# Altium schematic sheet ProtocolAnalyzer.SchDoc
size A; SheetNumber: 1; SheetTotal: 1
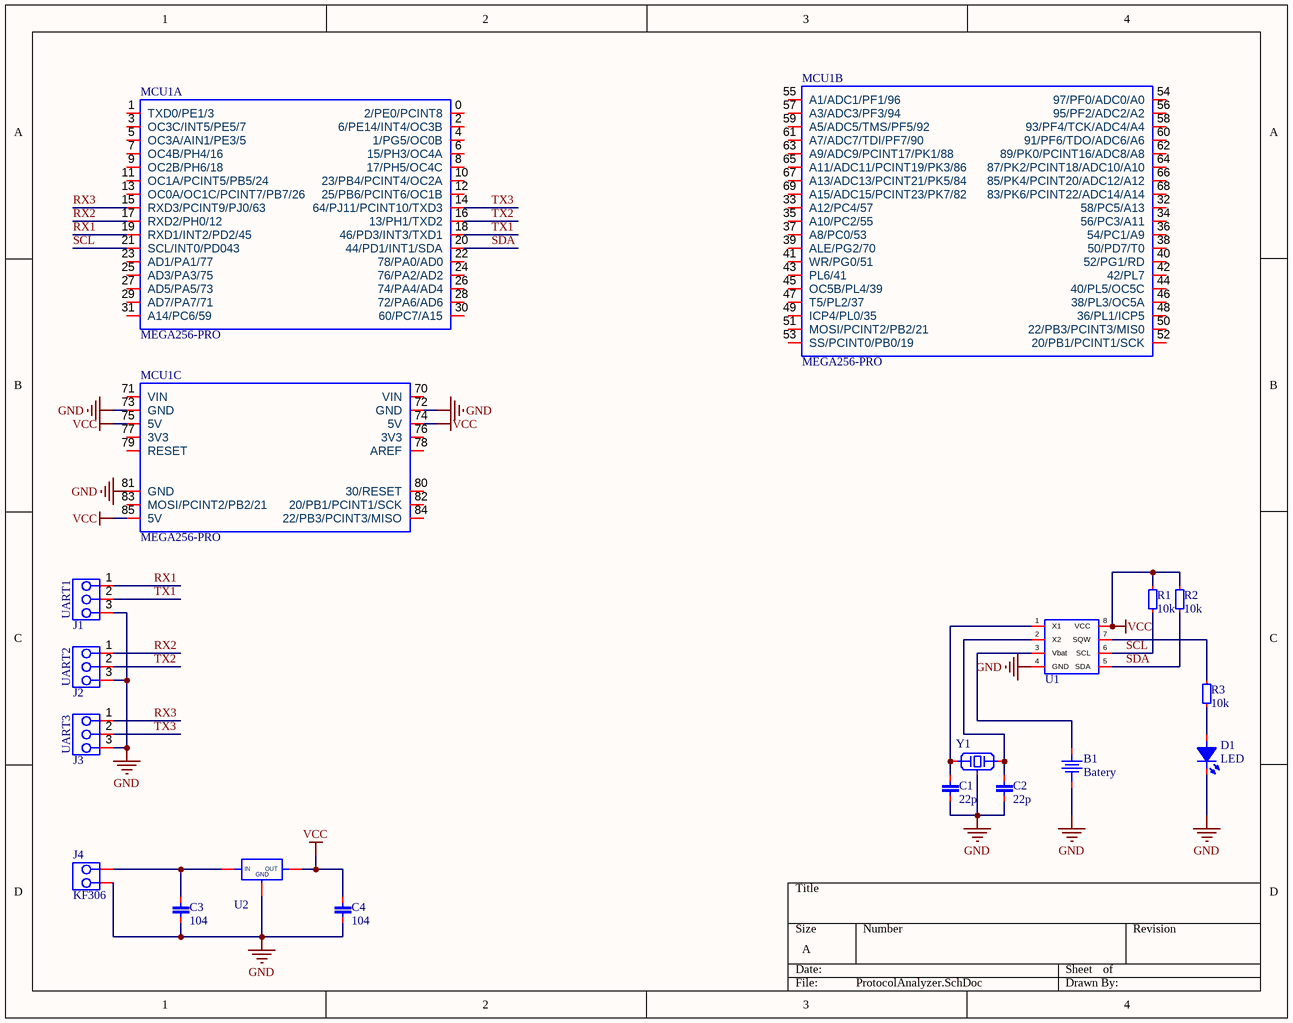
[diagram p0: ProtocolAnalyzer.SchDoc]

## Parts
B1  Batery  [CR1220]
C1  22p  [C0805]
C2  22p  [C0805]
C3  104  [C1206]
C4  104  [C1206]
D1  LED  [L0805RED]
J1  UART1  [JST - XH - Thru (R) - 3Pin - 2.54mm]
J2  UART2  [JST - XH - Thru (R) - 3Pin - 2.54mm]
J3  UART3  [JST - XH - Thru (R) - 3Pin - 2.54mm]
J4  KF306  [DG306-5.0-02P-12-00AH]
MCU1  MEGA256-PRO  [MEGA2560-PRO]  (parts A,B,C of 3)
R1  10k  [R0805]
R2  10k  [R0805]
R3  10k  [R0805]
U1  RealTime  [SOIC08_1.27_6.0]  (value not drawn)
U2  LM7805  [TO252-3]  (value not drawn)
Y1  32.768KHz  [DT-26]  (value not drawn)

## Nets
GND: B1.2 C1.1 C2.1 C3.2 C4.2 D1.2(K) J1.3 J2.3 J3.3 J4.2 MCU1.72(GND) MCU1.73(GND) MCU1.81(GND) U1.4(GND) U2.2(GND) Y1.3(GND)
VCC: C4.1 MCU1.74(5V) MCU1.75(5V) MCU1.85(5V) R1.2 R2.2 U1.8(VCC) U2.3(OUT)
RX1: J1.1 MCU1.19(RXD1/INT2/PD2/45)
RX2: J2.1 MCU1.17(RXD2/PH0/12)
RX3: J3.1 MCU1.15(RXD3/PCINT9/PJ0/63)
SCL: MCU1.21(SCL/INT0/PD043) R1.1 U1.6(SCL)
SDA: MCU1.20(44/PD1/INT1/SDA) R2.1 U1.5(SDA)
TX1: J1.2 MCU1.18(46/PD3/INT3/TXD1)
TX2: J2.2 MCU1.16(13/PH1/TXD2)
TX3: J3.2 MCU1.14(64/PJ11/PCINT10/TXD3)
NetB1_1: B1.1 U1.3(Vbat)
NetC1_2: C1.2 U1.1(X1) Y1.2
NetC2_2: C2.2 U1.2(X2) Y1.1
NetC3_1: C3.1 J4.1 U2.1(IN)
NetD1_1: D1.1(A) R3.1
NetR3_2: R3.2 U1.7(SQW)

Not connected (* = marked no-connect by the designer): MCU1 0(2/PE0/PCINT8) 1(TXD0/PE1/3) 2(6/PE14/INT4/OC3B) 3(OC3C/INT5/PE5/7) 4(1/PG5/OC0B) 5(OC3A/AIN1/PE3/5) 6(15/PH3/OC4A) 7(OC4B/PH4/16) 8(17/PH5/OC4C) 9(OC2B/PH6/18) 10(23/PB4/PCINT4/OC2A) 11(OC1A/PCINT5/PB5/24) 12(25/PB6/PCINT6/OC1B) 13(OC0A/OC1C/PCINT7/PB7/26) 22(78/PA0/AD0) 23(AD1/PA1/77) 24(76/PA2/AD2) 25(AD3/PA3/75) 26(74/PA4/AD4) 27(AD5/PA5/73) 28(72/PA6/AD6) 29(AD7/PA7/71) 30(60/PC7/A15) 31(A14/PC6/59) 32(58/PC5/A13) 33(A12/PC4/57) 34(56/PC3/A11) 35(A10/PC2/55) 36(54/PC1/A9) 37(A8/PC0/53) 38(50/PD7/T0) 39(ALE/PG2/70) 40(52/PG1/RD) 41(WR/PG0/51) 42(42/PL7) 43(PL6/41) 44(40/PL5/OC5C) 45(OC5B/PL4/39) 46(38/PL3/OC5A) 47(T5/PL2/37) 48(36/PL1/ICP5) 49(ICP4/PL0/35) 50(22/PB3/PCINT3/MIS0) 51(MOSI/PCINT2/PB2/21) 52(20/PB1/PCINT1/SCK) 53(SS/PCINT0/PB0/19) 54(97/PF0/ADC0/A0) 55(A1/ADC1/PF1/96) 56(95/PF2/ADC2/A2) 57(A3/ADC3/PF3/94) 58(93/PF4/TCK/ADC4/A4) 59(A5/ADC5/TMS/PF5/92) 60(91/PF6/TDO/ADC6/A6) 61(A7/ADC7/TDI/PF7/90) 62(89/PK0/PCINT16/ADC8/A8) 63(A9/ADC9/PCINT17/PK1/88) 64(87/PK2/PCINT18/ADC10/A10) 65(A11/ADC11/PCINT19/PK3/86) 66(85/PK4/PCINT20/ADC12/A12) 67(A13/ADC13/PCINT21/PK5/84) 68(83/PK6/PCINT22/ADC14/A14) 69(A15/ADC15/PCINT23/PK7/82) 70(VIN) 71(VIN) 76(3V3) 77(3V3) 78(AREF) 79(RESET) 80(30/RESET) 82(20/PB1/PCINT1/SCK) 83(MOSI/PCINT2/PB2/21) 84(22/PB3/PCINT3/MISO)

## Library data of the parts
C1-C4 = Capacitors(SMD)
D1 = LED0805
J1-J3 = JST - XH - Thru (R) - 3Pin - 2.54mm
J4 = DG306-5.0-02P-12-00AH
MCU1 = Arduino Mega 2560 Pro
R1-R3 = Resistors-SMD
U1 = RealTime-DS1307
U2 = Ic-LM7805
Y1 = Crystal 32.768KHz